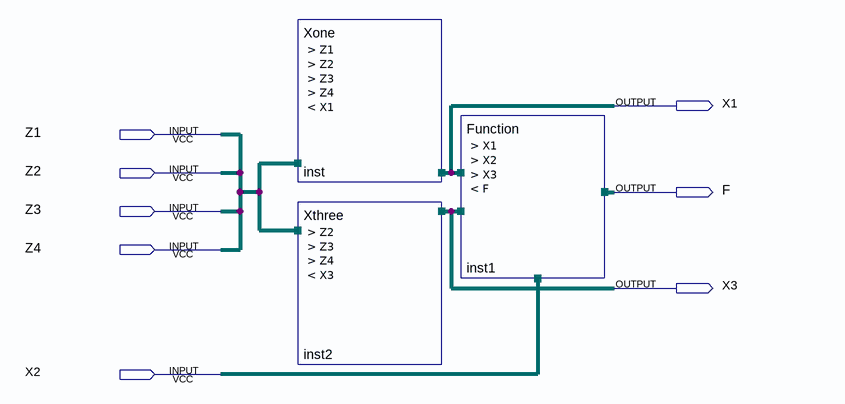
[diagram p0: schematic sheet]
// Quartus schematic main.bdf as structural Verilog: 3 symbols, 8 pins
module main (
  input  Z1,
  input  Z2,
  input  Z3,
  input  Z4,
  input  X2,
  output X1,
  output F,
  output X3
);

  Xone inst (.Z1(Z1), .Z2(Z2), .Z3(Z3), .Z4(Z4), .X1(X1));
  Xthree inst2 (.Z2(Z2), .Z3(Z3), .Z4(Z4), .X3(X3));
  Function inst1 (.X1(X1), .X2(X2), .X3(X3), .F(F));
endmodule
